# EAGLE design Qwiic_BMI270 (EAGLE 9.6.2)
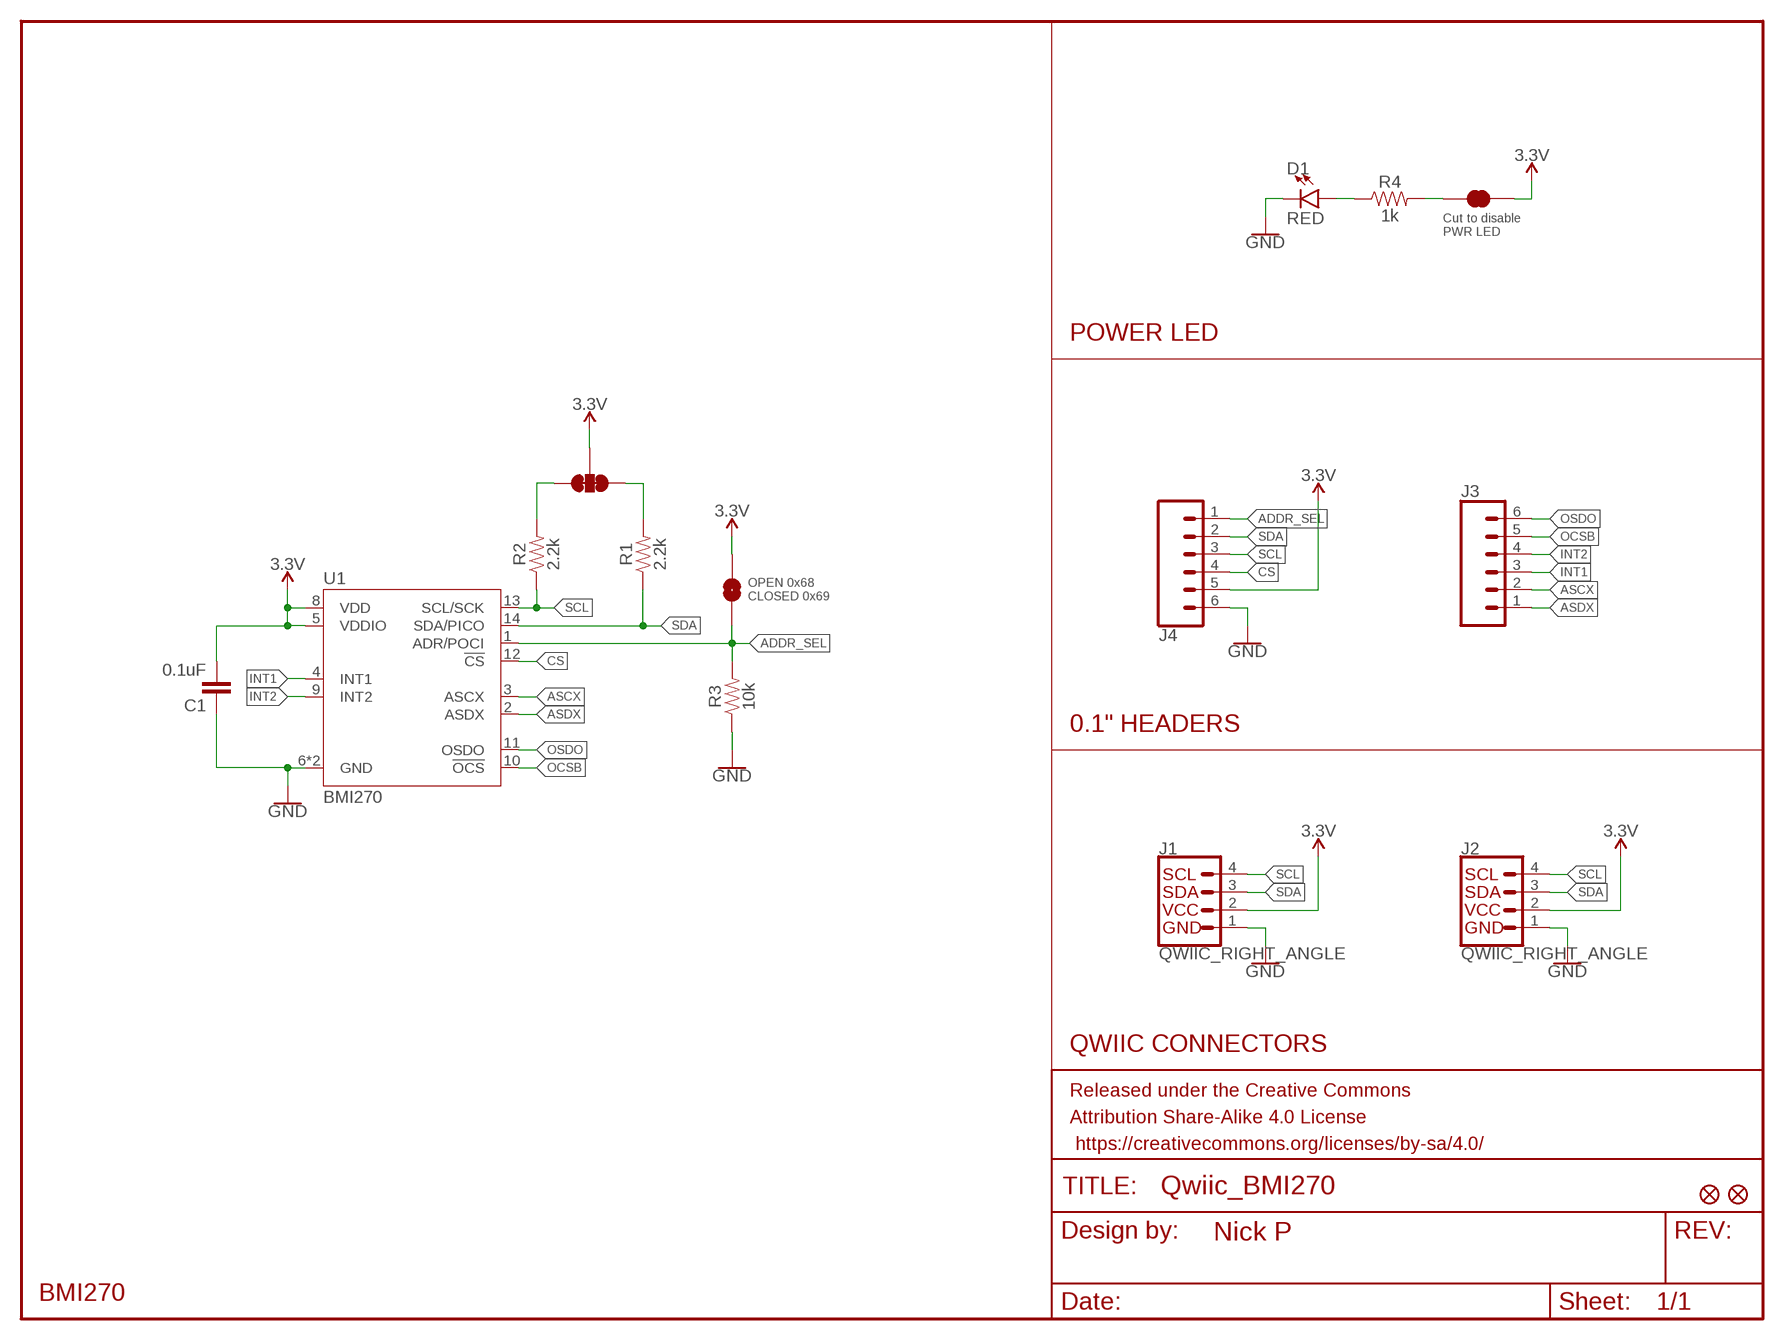
[diagram p0: schematic, sheet 1]

## Parts
C1  0.1uF  0.1UF-0603-25V-(+80/-20%)  [0603]
D1  RED  LED-RED0603  [LED-0603]
FD1  FIDUCIAL1X2  [FIDUCIAL-1X2]
FD2  FIDUCIAL1X2  [FIDUCIAL-1X2]
FRAME1  FRAME-LETTERNO_PACKAGE  [DUMMY]
J1  QWIIC_RIGHT_ANGLE  QWIIC_CONNECTORJS-1MM  [JST04_1MM_RA]
J2  QWIIC_RIGHT_ANGLE  QWIIC_CONNECTORJS-1MM  [JST04_1MM_RA]
J3  CONN_06NO_SILK_FEMALE_PTH  [1X06_NO_SILK]
J4  CONN_06NO_SILK_FEMALE_PTH  [1X06_NO_SILK]
JP1  JUMPER-SMT_3_2-NC_TRACE_SILK  [SMT-JUMPER_3_2-NC_TRACE_SILK]
JP2  JUMPER-SMT_2_NO_SILK  [SMT-JUMPER_2_NO_SILK]
JP3  JUMPER-SMT_2_NC_TRACE_SILK  [SMT-JUMPER_2_NC_TRACE_SILK]
R1  2.2k  2.2KOHM-0603-1/10W-1%  [0603]
R2  2.2k  2.2KOHM-0603-1/10W-1%  [0603]
R3  10k  10KOHM-0603-1/10W-1%  [0603]
R4  1k  1KOHM-0603-1/10W-1%  [0603]
U1  BMI270  [BMI270]

## Nets
3.3V: C1.2 J1.2 J2.2 J4.5 JP1.2 JP2.2 JP3.2 U1.5(VDDIO) U1.8(VDD)
ADDR_SEL: J4.1 JP2.1 R3.2 U1.1(ADR/POCI)
ASCX: J3.2 U1.3(ASCX)
ASDX: J3.1 U1.2(ASDX)
CS: J4.4 U1.12(!CS!)
GND: C1.1 D1.C J1.1 J2.1 J4.6 R3.1 U1.6(GND) U1.7(GND)
INT1: J3.3 U1.4(INT1)
INT2: J3.4 U1.9(INT2)
N$1: JP1.1 R1.2
N$2: JP1.3 R2.2
N$3: JP3.1 R4.2
N$4: D1.A R4.1
OCSB: J3.5 U1.10(!OCS!)
OSDO: J3.6 U1.11(OSDO)
SCL: J1.4 J2.4 J4.3 R2.1 U1.13(SCL/SCK)
SDA: J1.3 J2.3 J4.2 R1.1 U1.14(SDA/PICO)

## Notes on the sheet
- Cut to disable 
  PWR LED
- POWER LED
- OPEN 0x68
  CLOSED 0x69
- 0.1" HEADERS
- QWIIC CONNECTORS
- BMI270

## Library data of the parts
C1 = SparkFun-Capacitors:0.1UF: 0.1µF ceramic capacitors A capacitor is a passive two-terminal electrical component used to store electrical energy temporarily in an electric field.; PROD_ID: CAP-00810
D1 = SparkFun-LED:LED-RED: Red SMD LED Used in manufacturing of most products at SparkFun Packages: 0603 - KB - KingBright (DIO-17976) SMD 0603 package [Datasheet] <https://www.kingbrightusa.com/images/catalog/SPEC/APT1608SURCK.pdf> 0603 - (DIO-00819, has gone EOL) SMD 0603 package 0603 SMART - SMD 0603 SMART package ( more efficient and expensive)[Product Link] <http://www.osram-os.com/Graphics/XPic2/00077099_0.pdf> 1206 - SMD1206 package [Product Link] <https://www.sparkfun.com/datasheets/DevTools/LilyPad/Q150OVS4.pdff> SparkFun Products: Pro Mini 328 -5V <https://www.sparkfun.com/products/821> RedBoard <https://www.sparkfun.com/products/12757> IOIO-OTG <https://www.sparkfun.com/products/13613>; PROD_ID: DIO-00819
FD1 FD2 = SparkFun-Aesthetics:FIDUCIAL: Fiducial Alignment Points Point-of-reference for pick-and-place machines and other optical instruments.
FRAME1 = SparkFun-Aesthetics:FRAME-LETTER: Schematic Frame - Letter Standard 8.5x11 US Letter frame; DESIGNER: Nick P; VERSION: x01
J1 J2 = SparkFun-Connectors:QWIIC_CONNECTOR: SparkFun I2C Standard Qwiic Connector An SMD 1mm pitch JST connector makes it easy and quick (get it? Qwiic?) to connect I2C devices to each other. The Qwiic system <http://www.sparkfun.com/qwiic> enables fast and solderless connection between popular platforms and various sensors and actuators. We carry 200mm <https://www.sparkfun.com/products/14204>, 100mm <https://www.sparkfun.com/products/14205>, 50mm <https://www.sparkfun.com/products/14206>, and breadboard friendly <https://www.sparkfun.com/products/14207> Qwiic cables. We also offer 10 pcs strips <https://www.sparkfun.com/products/14323> the SMD connectors.; PROD_ID: CONN-13694
J3 J4 = SparkFun-Connectors:CONN_06: Multi connection point. Often used as Generic Header-pin footprint for 0.1 inch spaced/style header connections On any of the 0.1 inch spaced packages, you can populate with these: Break Away Headers - Straight <https://www.sparkfun.com/products/116> (PRT-00116) Break Away Male Headers - Right Angle <https://www.sparkfun.com/products/553> (PRT-00553) Female Headers <https://www.sparkfun.com/products/115> (PRT-00115) Break Away Headers - Machine Pin <https://www.sparkfun.com/products/117> (PRT-00117) Break Away Female Headers - Swiss Machine Pin <https://www.sparkfun.com/products/743> (PRT-00743) Arduino Stackable Header - 6 Pin <https://www.sparkfun.com/products/9280> (PRT-09280) Screw Terminals 2.54mm Pitch (6-Pin) <https://www.sparkfun.com/products/16499> (PRT-16499) For SCREWTERMINALS and SPRING TERMINALS visit here: Screw Terimnals on SparkFun.com <https://www.sparkfun.com/search/results?term=Screw+Terminals> (5mm/3.5mm/2.54mm spacing) This device is also useful as a general connection point to wire up your design to another part of your project. Our various solder wires solder well into these plated through hole pads. Hook-Up Wire - Assortment (Stranded, 22 AWG) <https://www.sparkfun.com/products/11375> (PRT-11375) Hook-Up Wire - Assortment (Solid Core, 22 AWG) <https://www.sparkfun.com/products/11367> (PRT-11367) View the entire wire category on our website here <https://www.sparkfun.com/categories/141>; PROD_ID: CONN-08437
JP1 = SparkFun-Jumpers:JUMPER-SMT_3_2-NC_TRACE: Normally closed trace jumper (2 of 2 connections) This jumper has a trace between all three pads so they are normally closed (NC). Use a razor knife to open the connection(s). For best results follow the IPC guidelines for cutting traces: Cutout at least 0.063 mm (0.005 in). Remove all loose material to clean up the cut area. Seal the cut with an approved epoxy. Reapply solder to reclose the connection(s).
JP2 = SparkFun-Jumpers:JUMPER-SMT_2_NO: Normally open jumper This jumper has two pads in close proximity to each other. Apply solder to close the connection. Round pads are easier to solder for beginners, but are a lot larger. SparkFun Product that uses the round pads: SparkFun EL Sequencer <https://www.sparkfun.com/products/12781>
JP3 = SparkFun-Jumpers:JUMPER-SMT_2_NC_TRACE: Normally closed trace jumper This jumper has a trace between two pads so it's normally closed (NC). Use a razor knife to open the connection. For best results follow the IPC guidelines for cutting traces: Cutout at least 0.063 mm (0.005 in). Remove all loose material to clean up the cut area. Seal the cut with an approved epoxy. Reapply solder to reclose the connection.
R1 R2 = SparkFun-Resistors:2.2KOHM: 2.2kΩ resistor A resistor is a passive two-terminal electrical component that implements electrical resistance as a circuit element. Resistors act to reduce current flow, and, at the same time, act to lower voltage levels within circuits. - Wikipedia; PROD_ID: RES-08272
R3 = SparkFun-Resistors:10KOHM: 10kΩ resistor A resistor is a passive two-terminal electrical component that implements electrical resistance as a circuit element. Resistors act to reduce current flow, and, at the same time, act to lower voltage levels within circuits. - Wikipedia; PROD_ID: RES-00824
R4 = SparkFun-Resistors:1KOHM: 1kΩ resistor A resistor is a passive two-terminal electrical component that implements electrical resistance as a circuit element. Resistors act to reduce current flow, and, at the same time, act to lower voltage levels within circuits. - Wikipedia; PROD_ID: RES-07856
U1 = BMI270:BMI270; PROD_ID: IC-15423

## Board
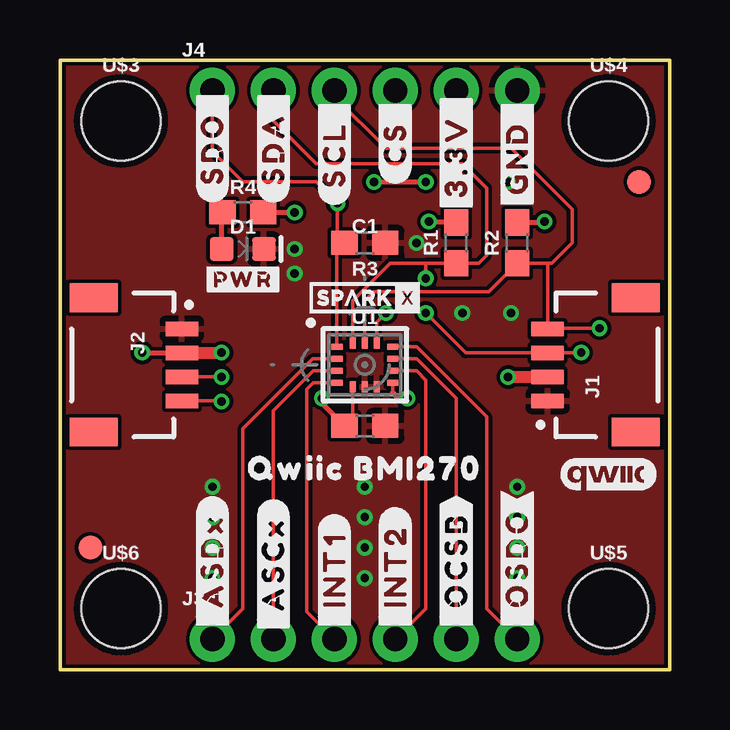
[diagram p1: board, top side]
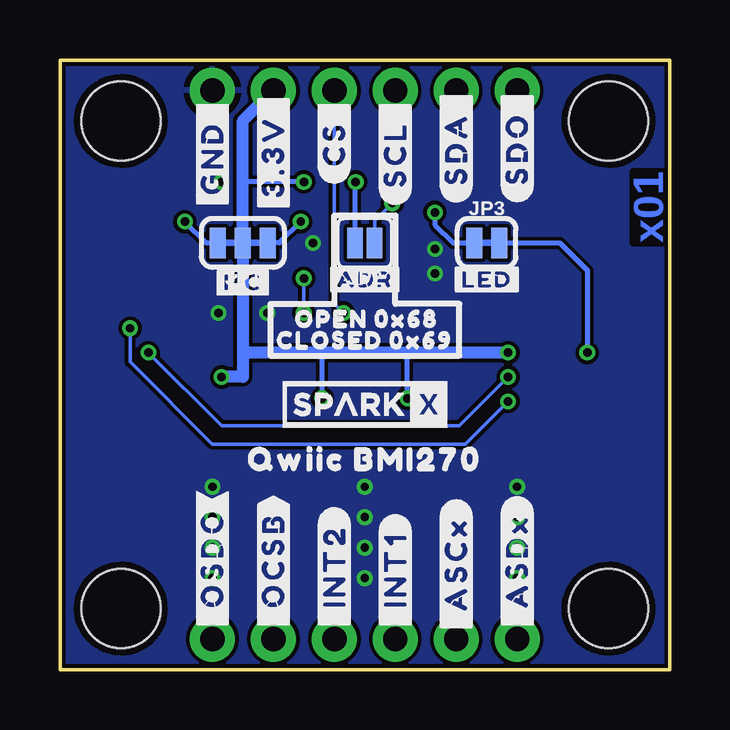
[diagram p2: board, bottom side, seen from below]

Size 25.4 x 25.4 mm. Coordinates in mm from the lower left corner, seen from the top.
Outline: 0,0 25.4,0 25.4,25.4 0,25.4 0,0
Copper layers (1*16): Top 0.035mm / dielectric 1.5mm / Bottom 0.035mm
Design rules "SparkFun-2-layer-PCBWay-LIMIT": minimum track width 6mil, minimum drill 0.3mm, track to track 6mil, track to pad 6mil, pad to pad 6mil, via to via 6mil, smd to smd 6mil, copper to edge 6mil, drill to drill 6mil, minimum pad ring 6mil, minimum via ring 6mil, stop-mask expansion 4mil, vias tented up to drill 25mil, thermal gap 10mil

### Footprints (pad centres in the part's own frame; a part is rotated, then mirrored left to right if it is on the bottom)
0603 = smd 1.1 x 1: 1 -0.85,0; 2 0.85,0
LED-0603 = smd 1 x 1: A -0.877,0; C 0.877,0
FIDUCIAL-1X2 = smd 1 x 1: 1 0,0
JST04_1MM_RA = smd 0.6 x 1.35: 1 -1.5,0; 2 -0.5,0; 3 0.5,0; 4 1.5,0 | smd 1.2 x 2: NC1 2.8,-3.675; NC2 -2.8,-3.675
1X06_NO_SILK = drill 1.016 pad 1.88: 1 0,0; 2 2.54,0; 3 5.08,0; 4 7.62,0; 5 10.16,0; 6 12.7,0
SMT-JUMPER_3_2-NC_TRACE_SILK = smd 0.66 x 1.27: 1 -1.041,0; 2 0,0; 3 1.041,0
SMT-JUMPER_2_NO_SILK = smd 0.635 x 1.27: 1 -0.406,0; 2 0.406,0
SMT-JUMPER_2_NC_TRACE_SILK = smd 0.66 x 1.27: 1 -0.521,0; 2 0.521,0
BMI270 = smd 0.475 x 0.25: 1 -1.163,0.75; 2 -1.163,0.25; 3 -1.163,-0.25; 4 -1.163,-0.75; 8 1.163,-0.75; 9 1.163,-0.25; 10 1.163,0.25; 11 1.163,0.75 | smd 0.25 x 0.475: 5 -0.5,-0.912; 6 0,-0.912; 7 0.5,-0.912; 12 0.5,0.912; 13 0,0.912; 14 -0.5,0.912
STAND-OFF = hole 3.302: 0,0

### Placement (x,y rotation side)
C1  12.7,10.16 180 top
D1  7.62,17.53 0 top
FD1  1.27,5.08 0 top
FD2  24.13,20.32 0 top
FRAME1  0,0 0 top
J1  20.32,12.7 90 top
J2  5.08,12.7 270 top
J3  6.35,1.27 0 top
J4  6.35,24.13 0 top
JP1  17.78,17.78 180 bottom
JP2  12.7,17.78 180 bottom
JP3  7.62,17.78 0 bottom
R1  16.51,17.78 90 top
R2  19.05,17.78 90 top
R3  12.7,17.78 180 top
R4  7.62,19.05 0 top
U1  12.7,12.7 0 top
U$2  [#3#3V_#4]  16.51,24.13 90 top
U$3  [STAND-OFF]  2.54,22.86 0 top
U$4  [STAND-OFF]  22.86,22.86 0 top
U$5  [STAND-OFF]  22.86,2.54 0 top
U$6  [STAND-OFF]  2.54,2.54 0 top
U$7  [#GND_#4]  19.05,23.88 90 top
U$8  [#CS_#3]  13.97,23.88 90 top
U$9  [#SCL_#2]  11.43,23.88 90 top
U$10  [#SDA_#1]  8.89,24.26 90 top
U$11  [#SDO_#0]  6.35,24.26 90 top
U$12  [#_OSDO#8]  19.05,1.52 90 top
U$13  [#_OCSB#7]  16.51,1.52 90 top
U$14  [#_INT1#7]  11.43,1.52 90 top
U$15  [#_INT2#7]  13.97,1.52 90 top
U$16  [#_ASCX#5]  8.89,1.4 90 top
U$17  [#_ASDX#6]  6.35,1.52 90 top
U$18  [#PWR#2711]  7.62,16.26 0 top
U$19  [QWIIC_BMI2709]  12.7,8.38 0 top
U$20  [SPARKX-TINY]  12.7,15.49 0 top
U$21  [#I�C#2714]  17.78,16.13 0 bottom
U$22  [#LED#2712]  7.62,16.26 0 bottom
U$23  [#ADR#2713]  12.7,16.26 0 bottom
U$24  [OPEN_0X682714]  16.13,14.61 0 bottom
U$25  [CLOSED_0X692714]  16.89,13.72 0 bottom
U$26  [QWIIC_BMI2709]  12.7,8.76 0 bottom
U$27  [SPARKX-SMALL]  12.7,11.05 0 bottom
U$28  [#_OSDO#8]  19.05,1.52 90 bottom
U$29  [#_OCSB#7]  16.51,1.52 90 bottom
U$30  [#_INT2#7]  13.97,1.52 90 bottom
U$31  [#_INT1#7]  11.43,1.52 90 bottom
U$32  [#_ASCX#5]  8.89,1.4 90 bottom
U$33  [#_ASDX#6]  6.35,1.52 90 bottom
U$34  [#GND_#4]  19.05,23.88 90 bottom
U$35  [#3#3V_#4]  16.51,24.13 90 bottom
U$36  [#CS_#3]  13.97,23.88 90 bottom
U$37  [#SCL_#2]  11.43,23.88 90 bottom
U$38  [#SDA_#1]  8.89,24.26 90 bottom
U$39  [#SDO_#0]  6.35,24.26 90 bottom
U$41  [QWIIC_4MM]  22.86,8.13 0 top

### Tracks (layer width: path | path; a pad name or v marks a point on that pad's centre or on a via)
3.3V  (via drill 0.35)
  Top 0.152: 12.2,10.16 C1.2 12.2,10.51 U1.5 | J2.2 | U1.8 13.86,11.54
  Top 0.203: v3.43,13.21 J2.2 | C1.2 10.92,11.09 v10.92,11.3 | v14.48,11.3 14.1,11.3 13.86,11.54 | v13.08,20.32 v15.24,20.32
  Top 0.508: v18.67,12.19 v18.68,12.2 J1.2 | J2.2 v6.72,13.2 v6.73,13.21
  Bottom 0.203: JP3.2 4.57,17.78 3.43,16.64 v3.43,13.21 | v14.48,11.3 14.48,13.21 | v10.92,11.3 10.92,13.21 | JP2.2 13.11,20.3 v13.08,20.32 | v15.24,20.32 17.78,20.32
  Bottom 0.508: J4.5 17.78,22.86 17.78,20.32 JP1.2 17.78,13.21 | 17.78,13.21 17.78,12.19 v18.67,12.19 | v6.73,13.21 10.92,13.21 14.48,13.21 17.78,13.21
ADDR_SEL  (via drill 0.35)
  Top 0.152: 11.54,17.78 R3.2 | R3.2 11.56,18.07 v11.56,19.43 10.67,20.32 7.62,20.32 6.35,21.59 J4.1 | U1.1 11.54,17.47 R3.2
  Bottom 0.152: v11.56,19.43 12.29,18.69 JP2.1
ASCX
  Top 0.152: J3.2 8.89,10.79 10.54,12.45 U1.3
ASDX
  Top 0.152: J3.1 7.62,2.54 7.62,10.03 10.53,12.95 U1.2
CS  (via drill 0.35)
  Top 0.152: v13.59,14.86 13.2,14.47 U1.12
  Bottom 0.152: v13.59,14.86 13.97,15.24 J4.4
GND  (via drill 0.35)
  other vias: 6.35,7.62 6.35,6.35 6.35,5.08 6.35,3.81 12.7,7.62 12.7,6.35 12.7,5.08 12.7,3.81 19.05,7.62 19.05,6.35 19.05,5.08 19.05,3.81 14.86,17.78 16.76,14.86 18.8,14.86 9.78,16.51 18.67,20.32 9.78,17.53
  pour Top: 0,0 25.4,0 25.4,25.4 0,25.4
  pour Bottom: 0,0 25.4,0 25.4,25.4 0,25.4
INT1
  Top 0.152: J3.3 10.29,2.41 10.29,11.68 10.55,11.95 U1.4
INT2
  Top 0.152: J3.4 15.24,2.54 15.24,12.06 14.86,12.45 U1.9
N$1  (via drill 0.35)
  Top 0.152: 15.41,18.63 v15.37,18.67
  Top 0.203: R1.2 15.41,18.63
  Bottom 0.203: v15.37,18.67 16.26,17.78 JP1.1
N$2  (via drill 0.35)
  Top 0.152: 20.15,18.63 v20.19,18.67
  Top 0.203: R2.2 20.15,18.63
  Bottom 0.203: v20.19,18.67 19.3,17.78 JP1.3
N$3  (via drill 0.35)
  Top 0.203: R4.2 v9.78,19.05
  Bottom 0.203: v9.78,19.05 9.78,18.54 9.02,17.78 JP3.1
N$4
  Top 0.203: D1.A 6.74,19.02 R4.1
OCSB
  Top 0.152: J3.5 16.51,11.3 14.86,12.95 U1.10
OSDO
  Top 0.152: J3.6 17.78,2.54 17.78,10.54 14.86,13.46 13.87,13.46 U1.11
SCL  (via drill 0.35)
  Top 0.152: 20.32,16.93 R2.1 17.87,15.75 13.08,15.75 12.7,15.37 U1.13 | 20.32,16.93 20.49,16.93 21.34,17.78 21.34,19.18 18.8,21.72 13.59,21.72 11.43,23.88 J4.3 | 20.32,16.93 J1.4 20.34,14.22 v22.48,14.22 | J2.4 6.71,11.2 v6.73,11.18
  Bottom 0.152: v6.73,11.18 8.51,9.4 19.05,9.4 22.48,12.83 v22.48,14.22
SDA  (via drill 0.35)
  Top 0.152: 15.24,16.93 R1.1 17.44,16.93 17.78,17.27 17.78,20.07 16.76,21.08 10.67,21.08 8.89,22.86 J4.2 | 15.24,16.93 13.76,16.93 12.2,15.38 U1.14 | v15.24,14.86 16.9,13.2 J1.3 21.71,13.2 v21.72,13.21 | v15.24,16.3 15.24,16.93 | J2.3 v6.72,12.2 v6.73,12.19
  Bottom 0.152: v15.24,14.86 v15.24,16.3 | v6.73,12.19 8.76,10.16 18.67,10.16 v21.72,13.21

### Text on the board
Bottom: x01